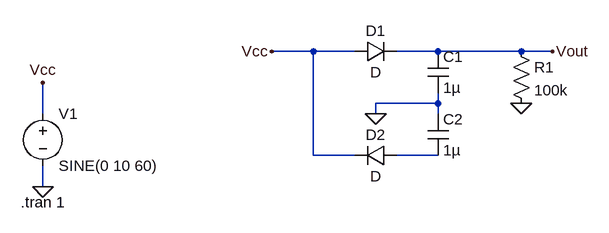
[diagram p0: schematic full_bridge.asc]
full_bridge.asc, the LTspice schematic file:
Version 4
SHEET 1 888 680
WIRE 416 32 352 32
WIRE 480 32 416 32
WIRE 608 32 544 32
WIRE 736 32 608 32
WIRE 784 32 736 32
WIRE 608 112 608 96
WIRE 608 112 512 112
WIRE 0 128 0 80
WIRE 512 128 512 112
WIRE 608 128 608 112
WIRE 416 192 416 32
WIRE 480 192 416 192
WIRE 608 192 544 192
WIRE 0 240 0 208
FLAG 0 240 0
FLAG 0 80 Vcc
FLAG 352 32 Vcc
FLAG 512 128 0
FLAG 784 32 Vout
FLAG 736 112 0
SYMBOL voltage 0 112 R0
WINDOW 123 0 0 Left 0
WINDOW 39 0 0 Left 0
SYMATTR InstName V1
SYMATTR Value SINE(0 10 60)
SYMBOL diode 480 48 R270
WINDOW 0 32 32 VTop 2
WINDOW 3 0 32 VBottom 2
SYMATTR InstName D1
SYMBOL diode 544 176 R90
WINDOW 0 0 32 VBottom 2
WINDOW 3 32 32 VTop 2
SYMATTR InstName D2
SYMBOL cap 592 32 R0
SYMATTR InstName C1
SYMATTR Value 1µ
SYMBOL cap 592 128 R0
SYMATTR InstName C2
SYMATTR Value 1µ
SYMBOL res 720 16 R0
SYMATTR InstName R1
SYMATTR Value 100k
TEXT -34 264 Left 2 !.tran 1

The netlist it stands for:
* full_bridge.asc
V1 Vcc 0 SINE(0 10 60)
D1 Vcc Vout D
D2 N001 Vcc D
C1 Vout 0 1µ
C2 0 N001 1µ
R1 Vout 0 100k
.model D D
.lib standard.dio
.tran 1
.backanno
.end